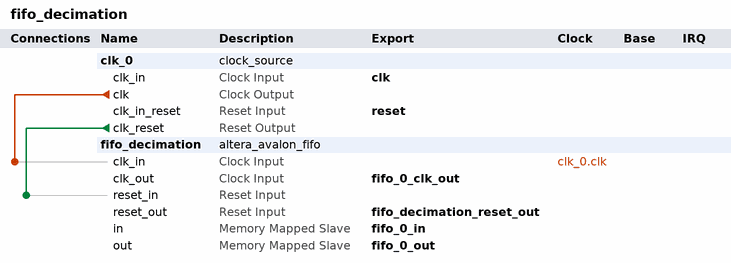
[diagram p0: system contents]
# Platform Designer (Qsys) system fifo_decimation, Cyclone V 5CEBA4F23C7
# Parameters at their usual value, and those the tool derives, are not listed.
package require -exact qsys 17.0
create_system fifo_decimation
set_project_property DEVICE_FAMILY {Cyclone V}
set_project_property DEVICE 5CEBA4F23C7

add_instance clk_0 clock_source 17.0
set_instance_parameter_value clk_0 clockFrequency 50000000

add_instance fifo_decimation altera_avalon_fifo 17.0
set_instance_parameter_value fifo_decimation bitsPerSymbol 16
set_instance_parameter_value fifo_decimation channelWidth 8
set_instance_parameter_value fifo_decimation errorWidth 8
set_instance_parameter_value fifo_decimation fifoDepth 32
set_instance_parameter_value fifo_decimation fifoInputInterfaceOptions AVALONMM_WRITE
set_instance_parameter_value fifo_decimation fifoOutputInterfaceOptions AVALONMM_READ
set_instance_parameter_value fifo_decimation singleClockMode false
set_instance_parameter_value fifo_decimation symbolsPerBeat 2
set_instance_parameter_value fifo_decimation useIRQ true
set_instance_parameter_value fifo_decimation usePacket true
set_instance_parameter_value fifo_decimation useReadControl false
set_instance_parameter_value fifo_decimation useWriteControl false

# connections
add_connection clk_0.clk fifo_decimation.clk_in clock
add_connection clk_0.clk_reset fifo_decimation.reset_in reset

# exported interfaces
add_interface clk clock sink
set_interface_property clk EXPORT_OF clk_0.clk_in
add_interface fifo_0_clk_out clock sink
set_interface_property fifo_0_clk_out EXPORT_OF fifo_decimation.clk_out
add_interface fifo_0_in avalon slave
set_interface_property fifo_0_in EXPORT_OF fifo_decimation.in
add_interface fifo_0_out avalon slave
set_interface_property fifo_0_out EXPORT_OF fifo_decimation.out
add_interface fifo_decimation_reset_out reset sink
set_interface_property fifo_decimation_reset_out EXPORT_OF fifo_decimation.reset_out
add_interface reset reset sink
set_interface_property reset EXPORT_OF clk_0.clk_in_reset

set_interconnect_requirement {$system} qsys_mm.clockCrossingAdapter HANDSHAKE
set_interconnect_requirement {$system} qsys_mm.enableEccProtection FALSE
set_interconnect_requirement {$system} qsys_mm.insertDefaultSlave FALSE
set_interconnect_requirement {$system} qsys_mm.maxAdditionalLatency 1

save_system fifo_decimation.qsys
